# EAGLE design Tastereinheit (EAGLE 7.5.0)
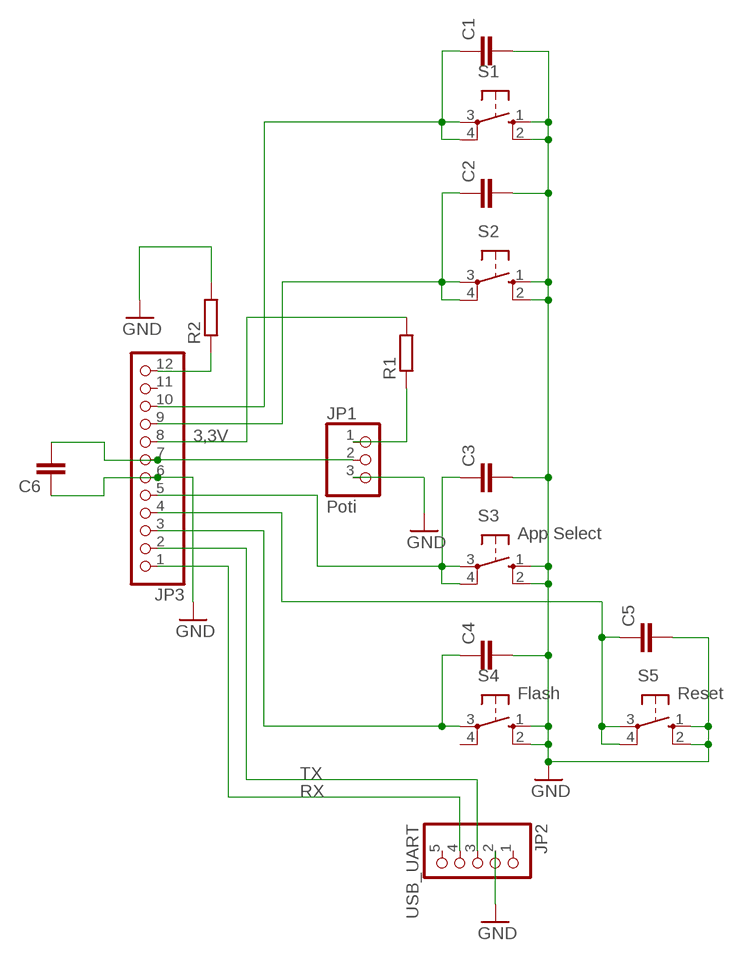
[diagram p0: schematic, sheet 1]

## Parts
C1  C-EUC0805  [C0805]
C2  C-EUC0805  [C0805]
C3  C-EUC0805  [C0805]
C4  C-EUC0805  [C0805]
C5  C-EUC0805  [C0805]
C6  C-EUC0805  [C0805]
JP1  Poti  PINHD-1X3/90  [1X03/90]
JP2  USB_UART  PINHD-1X5/90  [1X05/90]
JP3  PINHD-1X12/90  [1X12/90]
R1  R-EU_R0805  [R0805]
R2  R-EU_R0805  [R0805]
S1  10-XX  [B3F-10XX]
S2  10-XX  [B3F-10XX]
S3  App Select  10-XX  [B3F-10XX]
S4  Flash  10-XX  [B3F-10XX]
S5  Reset  10-XX  [B3F-10XX]

## Nets
3,3V: JP3.8 R1.2
GND: C1.2 C2.2 C3.2 C4.2 C5.2 C6.1 JP1.3 JP2.2 JP3.6 R2.2 S1.1(S) S1.2(S1) S2.1(S) S2.2(S1) S3.1(S) S3.2(S1) S4.1(S) S4.2(S1) S5.1(S) S5.2(S1)
N$1: JP1.1 R1.1
N$2: C4.1 JP3.3 S4.3(P)
N$3: C3.1 JP3.5 S3.3(P) S3.4(P1)
N$4: C2.1 JP3.9 S2.3(P) S2.4(P1)
N$5: C1.1 JP3.10 S1.3(P) S1.4(P1)
N$6: C6.2 JP1.2 JP3.7
N$8: C5.1 JP3.4 S5.3(P) S5.4(P1)
N$10: JP3.12 R2.1
RX: JP2.4 JP3.1
TX: JP2.3 JP3.2
Unconnected: JP2.1 JP2.5 JP3.11 S4.4(P1)

## Library data of the parts
C1-C6 = rcl:C-EU: CAPACITOR, European symbol
JP1 = pinhead:PINHD-1X3: PIN HEADER
JP2 = pinhead:PINHD-1X5: PIN HEADER
JP3 = pinhead:PINHD-1X12: PIN HEADER
R1 R2 = rcl:R-EU_: RESISTOR, European symbol
S1-S5 = switch-omron:10-XX: OMRON SWITCH; MPN: B3F-1000; OC_FARNELL: 176432; OC_NEWARK: 36M3542

## Board
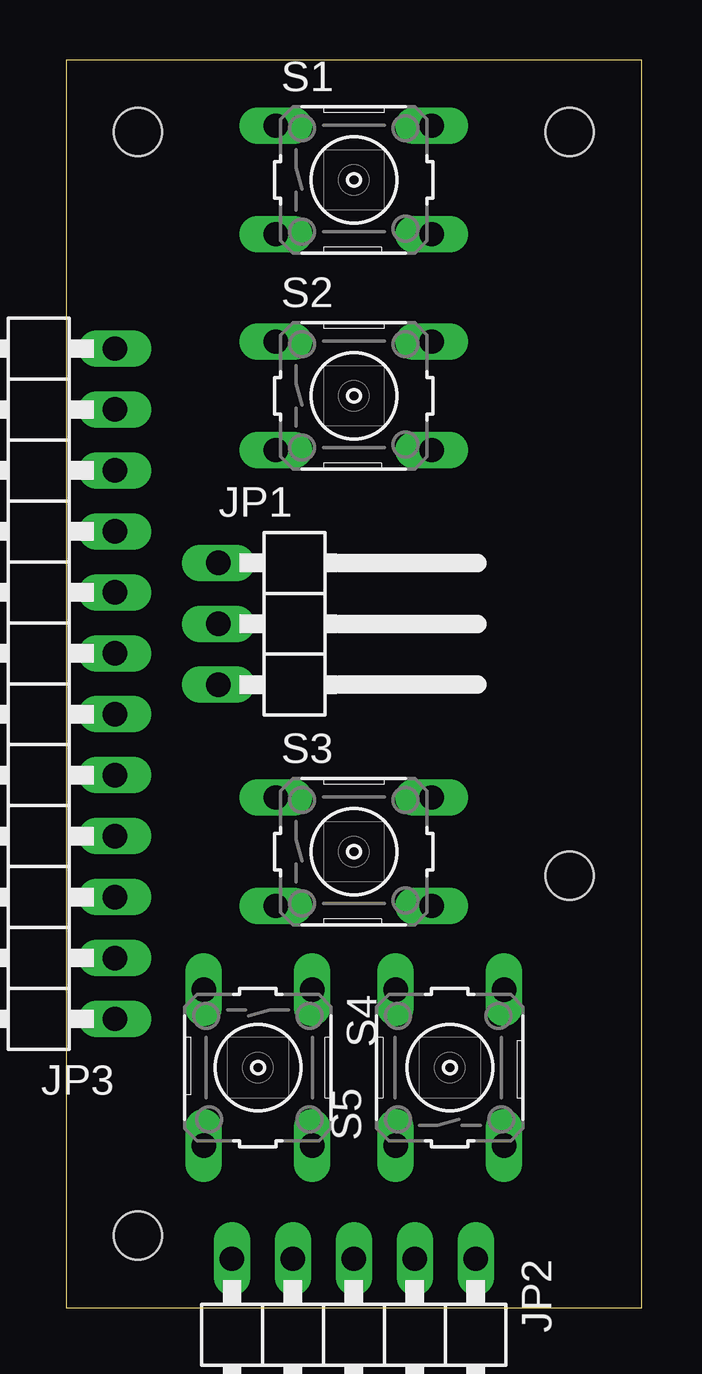
[diagram p1: board, top side]
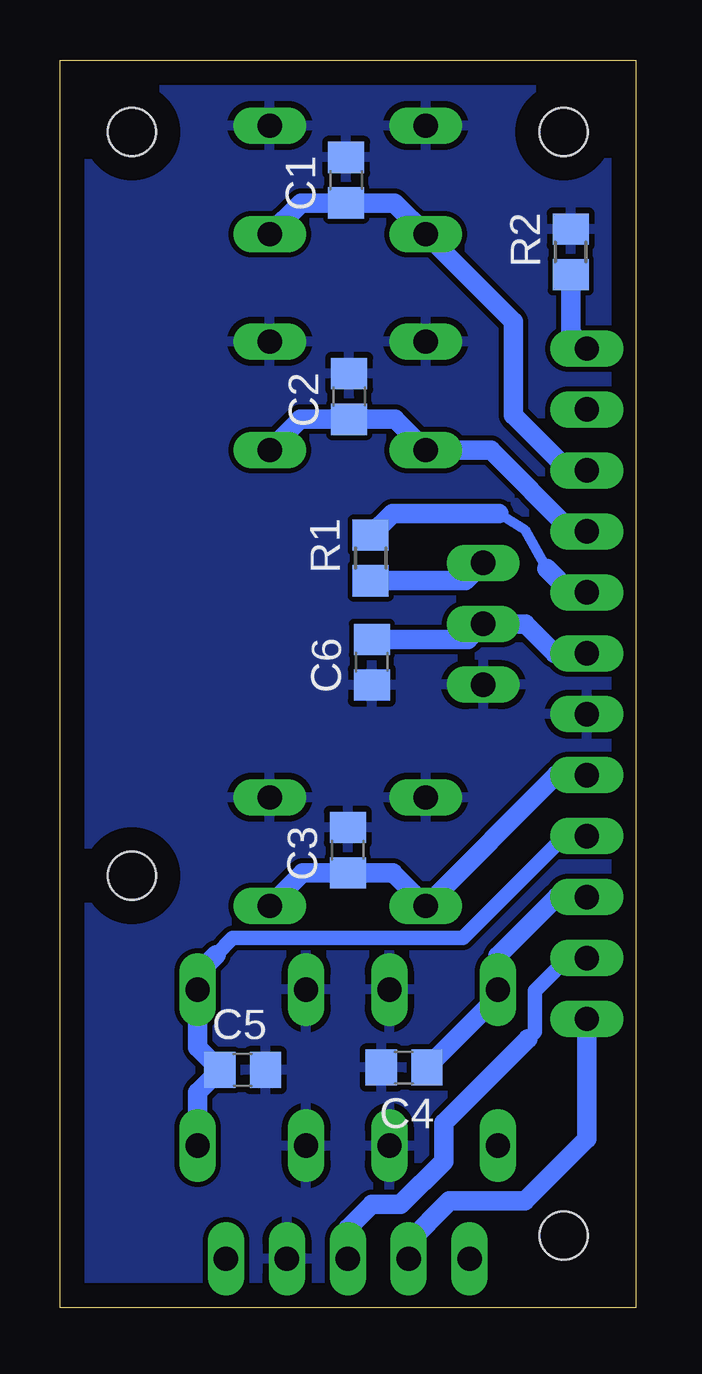
[diagram p2: board, bottom side, seen from below]

Size 24 x 52 mm. Coordinates in mm from the lower left corner, seen from the top.
Outline: 0,0 24,0 24,52 0,52 0,0
Copper layers (1*16): Top 0.035mm / dielectric 1.5mm / Bottom 0.035mm
Design rules "default": minimum track width 10mil, minimum drill 24mil, track to track 8mil, track to pad 8mil, pad to pad 8mil, via to via 8mil, smd to smd 8mil, copper to edge 40mil, drill to drill 8mil, minimum pad ring 10mil, minimum via ring 8mil, stop-mask expansion 4mil, vias tented up to drill 0mil, thermal gap 10mil
Holes 2 mm at 3,3 21,18 21,49 3,49

### Footprints (pad centres in the part's own frame; a part is rotated, then mirrored left to right if it is on the bottom)
C0805 = smd 1.3 x 1.5: 1 -0.95,0; 2 0.95,0
1X03/90 = drill 1.016 long: 1 -2.54,-3.81; 2 0,-3.81; 3 2.54,-3.81
1X05/90 = drill 1.016 long: 1 -5.08,-3.81; 2 -2.54,-3.81; 3 0,-3.81; 4 2.54,-3.81; 5 5.08,-3.81
1X12/90 = drill 1.016 long: 1 -13.97,-3.81; 2 -11.43,-3.81; 3 -8.89,-3.81; 4 -6.35,-3.81; 5 -3.81,-3.81; 6 -1.27,-3.81; 7 1.27,-3.81; 8 3.81,-3.81; 9 6.35,-3.81; 10 8.89,-3.81; 11 11.43,-3.81; 12 13.97,-3.81
R0805 = smd 1.3 x 1.5: 1 -0.95,0; 2 0.95,0
B3F-10XX = drill 1.016 long: 1 -3.251,2.261; 2 3.251,2.261; 3 -3.251,-2.261; 4 3.251,-2.261

### Placement (x,y rotation side)
C1  12.06,46.99 90 bottom
C2  11.94,37.97 90 bottom
C3  12,19.07 90 bottom
C4  9.65,10.01 180 bottom
C5  16.38,9.91 0 bottom
C6  11,26.9 90 bottom
JP1  10.16,28.5 270 top
JP2  12,-1.78 180 top
JP3  -1.78,26 90 top
R1  11.05,31.24 90 bottom
R2  2.7,44 90 bottom
S1  12,47 0 top
S2  12,38 0 top
S3  12,19 0 top
S4  8,10 270 top
S5  16,10 90 top

### Tracks (layer width: path | path; a pad name or v marks a point on that pad's centre or on a via)
3,3V
  Bottom 0.406: 3.7,30.8 4.6,32.4 5.7,33.1
  Bottom 0.813: JP3.8 2.71,29.81 3.7,30.8 | 5.7,33.1 10.14,33.1 R1.2
GND
  pour Bottom: 0.5,51.5 23.5,51.5 23.5,0.5 0.5,0.5
N$1
  Bottom 0.813: R1.1 7.1,30.29 JP1.1
N$2
  Bottom 0.813: JP3.3 3.29,17.11 5.74,14.66 S4.3 5.74,12.97 C4.1
N$3
  Bottom 0.813: JP3.5 3.3,22.19 S3.3 10.12,18.11 C3.1 13.88,18.11 S3.4
N$4
  Bottom 0.813: JP3.9 2.65,32.35 6.04,35.74 S2.3 10.03,37.02 C2.1 13.97,37.02 S2.4
N$5
  Bottom 0.813: JP3.10 2.79,34.89 5.1,37.2 5.1,41.09 S1.3 10.05,46.04 C1.1 13.95,46.04 S1.4
N$6
  Bottom 0.813: JP3.7 3.37,27.27 4.6,28.5 JP1.2 7,27.85 C6.2
N$8
  Bottom 0.61: 17.5,14.7 16.8,15.4 7.2,15.4 2.95,19.65 JP3.4
  Bottom 0.813: S5.3 18.26,8.98 C5.1 18.26,10.83 S5.4 18.26,13.94 17.5,14.7
N$10
  Bottom 0.813: JP3.12 2.7,40.64 R2.1
RX
  Bottom 0.813: JP3.1 2.03,7.02 4.61,4.45 7.75,4.45 9.5,2.7 9.5,2.07 JP2.4
TX
  Bottom 0.61: 4.5,11.2 4.2,11.5 4.2,13.2 2.83,14.57 JP3.2
  Bottom 0.813: JP2.3 12,3.3 11,4.3 9.8,4.3 8,6.1 8,7.7 4.5,11.2